# EasyEDA Pro project DCDC.eprj, schematic BOOST
Board Name: BOOST; Create Date: 2025-07-11; Page Name: BOOST; Project Name: DCDC; Schematic Name: BOOST; Update Date: 2025-07-11; Company: 嘉立创EDA; Page Size: A4; Version: V1.0
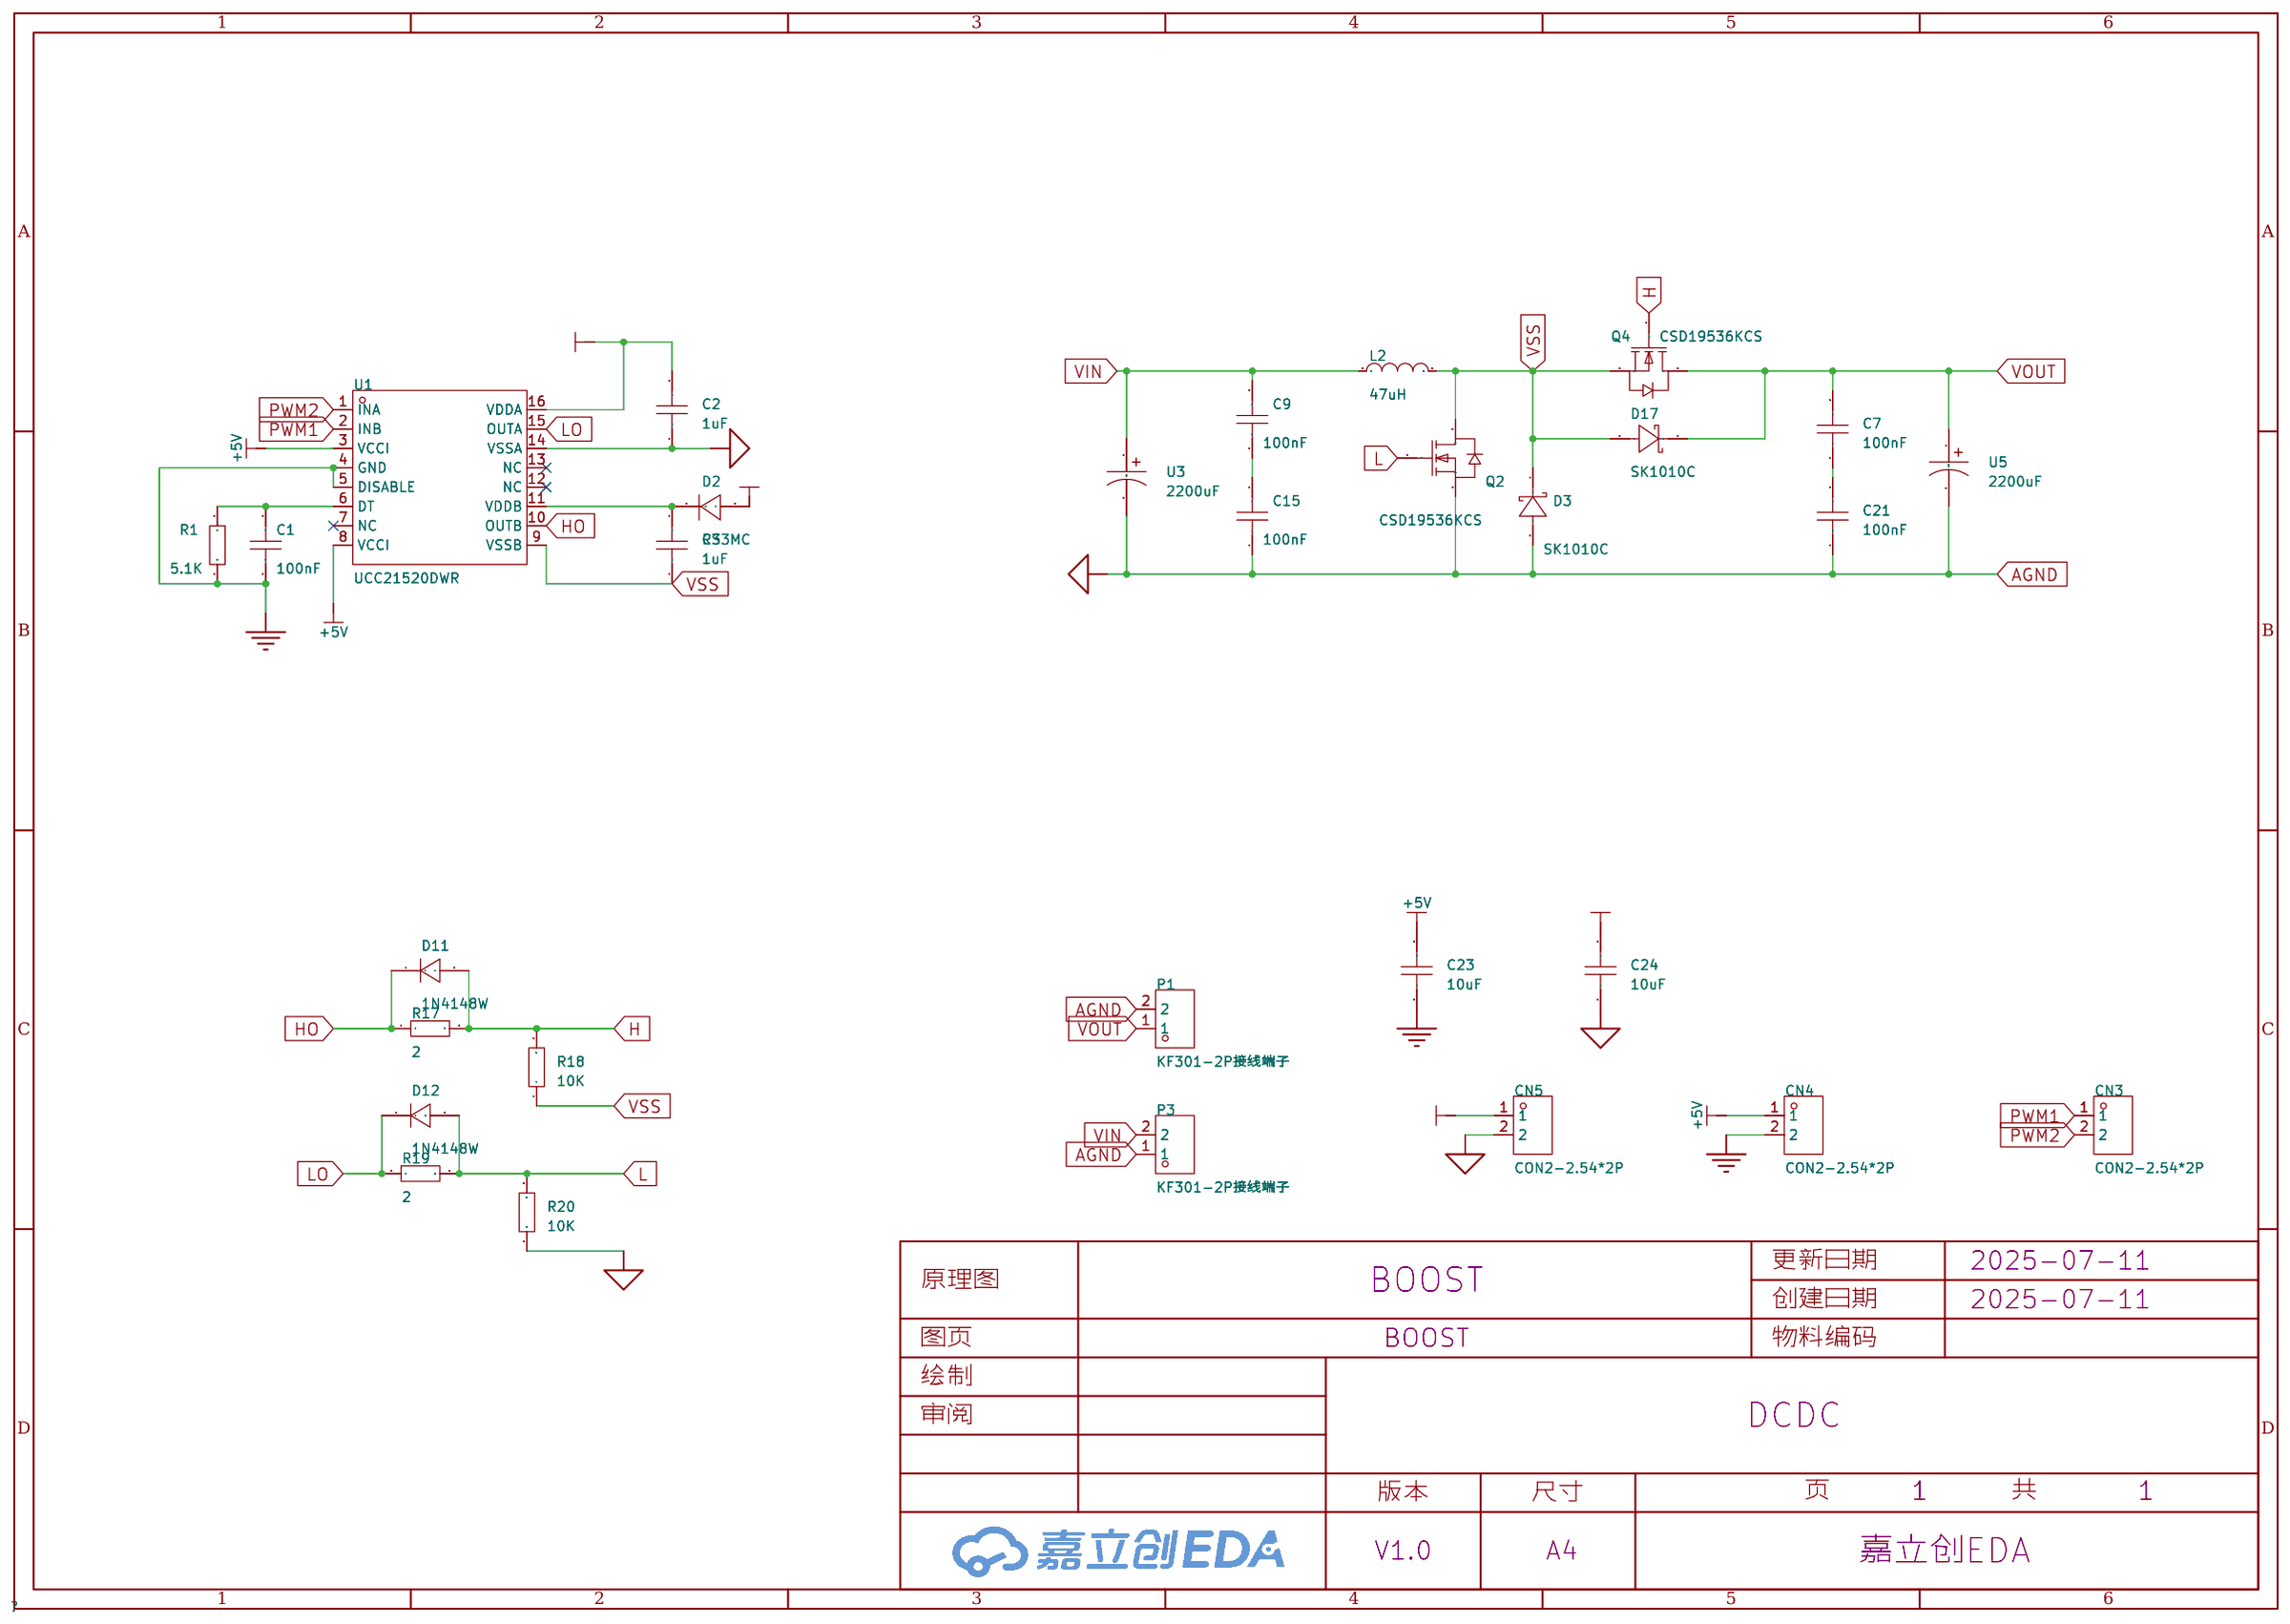
[diagram p3: schematic sheet]

## Parts
C1  100nF  [C0805]
C2  1uF  [C0805]
C3  1uF  [C0805]
C7  100nF  [C0805]
C9  100nF  [C0805]
C15  100nF  [C0805]
C21  100nF  [C0805]
C23  10uF  [C0805]
C24  10uF  [C0805]
CN3  CON2-2.54*2P  [CONN-TH_2P-P2.54-V]
CN4  CON2-2.54*2P  [CONN-TH_2P-P2.54-V]
CN5  CON2-2.54*2P  [CONN-TH_2P-P2.54-V]
D2  RS3MC  [SMC_L7.1-W6.2-LS8.1-R-RD]
D3  SK1010C  [SMC_L6.9-W5.9-LS7.9-RD]
D11  1N4148W  [SOD-123F_L2.7-W1.6-LS3.8-RD]
D12  1N4148W  [SOD-123F_L2.7-W1.6-LS3.8-RD]
D17  SK1010C  [SMC_L6.9-W5.9-LS7.9-RD]
L2  47uH  [IND-TH_L33.0-W16.0-P17.00-D1.5]
P1  KF301-2P接线端子  [CONN-TH_XY301V-A-5.0-2P]
P3  KF301-2P接线端子  [CONN-TH_XY301V-A-5.0-2P]
Q2  CSD19536KCS  [TO-220-3_L10.0-W4.5-P2.54-L]
Q4  CSD19536KCS  [TO-220-3_L10.0-W4.5-P2.54-L]
R1  5.1K  [R0805]
R17  2  [R0805]
R18  10K  [R0805]
R19  2  [R0805]
R20  10K  [R0805]
U1  UCC21520DWR  [SOIC-16_L10.3-W7.5-P1.27-LS10.3-BL]
U3  2200uF  [CAP-TH_BD22.0-P10.00-D1.4-FD]
U5  2200uF  [CAP-TH_BD22.0-P10.00-D1.4-FD]

## Library data of the parts
C1-C3 C7 C9 C15 C21 C23 C24 = CAP_0805: Supplier Footprint: 0805
CN3-CN5 = CON2-2.54*2P: Supplier Part: C9900003238; Supplier Footprint: TH-2P; JLCPCB Part Class: Extended Part; Supplier: LCSC
D2 = RS3MC_C15283: 二极管配置:独立式;正向压降(Vf):1.3V@3A;直流反向耐压(Vr):1kV;整流电流:3A;反向恢复时间(trr):500ns;; LCSC Part Name: 电压:1kV 电流:3A; Supplier Part: C15283; Manufacturer: MDD(辰达半导体); Supplier Footprint: SMC; JLCPCB Part Class: 扩展库; Datasheet: https://atta.szlcsc.com/upload/public/pdf/source/20240809/311FA8487617F5AA976E3BC15CA3A541.pdf; Supplier: LCSC; Diode Configuration: 独立式; Forward Voltage (Vf@If): 1.3V@3A; Reverse Voltage (Vr): 1kV; Rectified Current: 3A; Reverse Leakage Current: 5uA@1kV; Reverse Recovery Time (trr): 500ns; Operating Temperature: -55℃~+150℃@(Tj)
D3 D17 = SK106C_C18199210: LCSC Part Name: 电压:60V 电流:10A; Supplier Part: C18199210; Manufacturer: 宏迦橙; Supplier Footprint: SMC; JLCPCB Part Class: Extended Part; Datasheet: https://atta.szlcsc.com/upload/public/pdf/source/20230925/90F2340DC9BC2B2517F18AABBBD1A464.pdf; Supplier: LCSC; Diode Configuration: 独立式; Forward Voltage (Vf@If): 700mV@10A; Reverse Voltage (Vr): 60V; Rectified Current: 10A; Reverse Leakage Current (Ir): 500uA@60V
D11 D12 = 1N4148W_C81598: LCSC Part Name: 电压:75V 电流:150mA; Supplier Part: C81598; Manufacturer: ST(先科); Supplier Footprint: SOD-123; JLCPCB Part Class: Basic Part; Datasheet: https://atta.szlcsc.com/upload/public/pdf/source/20161024/1477288446905.pdf; Supplier: LCSC; Diode Configuration: 独立式; Forward Voltage (Vf@If): 1V@50mA; Reverse Voltage (Vr): 75V; Average Rectified Current (Io): 150mA; Power Dissipation: 400mW; Reverse Leakage Current: 1uA@75V; Reverse Recovery Time (trr): 4ns
L2 = XR106125TS470MV1L: LCSC Part Name: 带热缩套管; Supplier Part: C22358528; Manufacturer: XR(祥如); Supplier Footprint: 插件,33x15.6mm; JLCPCB Part Class: 扩展库; Datasheet: https://atta.szlcsc.com/upload/public/pdf/source/20240313/3B46D856669B9C4B865D9288641DA483.pdf; Supplier: LCSC; Tolerance: ±10%; Current Rating: 5A; Type: 磁环电感; Wire Diameter: 1mm
P1 P3 = KF301-2P接线端子: Supplier Part: C9900016950; Supplier Footprint: CK301-2P; JLCPCB Part Class: Extended Part; Supplier: LCSC
Q2 Q4 = CSD19536KCS: LCSC Part Name: 1个N沟道 耐压:100V 电流:150A; Supplier Part: C206030; Manufacturer: TI(德州仪器); Supplier Footprint: TO-220; JLCPCB Part Class: 扩展库; Datasheet: https://www.ti.com/cn/lit/gpn/csd19536kcs; Supplier: LCSC; Type: 1个N沟道; Drain Source Voltage (Vdss): 100V; Continuous Drain Current (Id): 150A; Power Dissipation (Pd): 375W; Drain Source On Resistance (RDS(on)@Vgs,Id): 2.7mΩ@10V,100A; Gate Threshold Voltage (Vgs(th)@Id): 3.2V@250uA; Total Gate Charge (Qg@Vgs): 153nC@10V; Input Capacitance (Ciss@Vds): 12nF@50V; Operating Temperature: -55℃~+175℃@(Tj)
R1 R17-R20 = Res_0805: Supplier Footprint: 0805
U1 = UCC21520DWR: Supplier Part: C601651; Manufacturer: TI(德州仪器); Supplier Footprint: SOIC-16-300mil; JLCPCB Part Class: 扩展库; Datasheet: https://www.ti.com/cn/lit/gpn/ucc21520; Supplier: LCSC
U3 U5 = ERH2WM221O46OT: LCSC Part Name: 220uF ±20% 450V; Supplier Part: C2937537; Manufacturer: AISHI(艾华集团); Supplier Footprint: 插件,D22xL46mm; JLCPCB Part Class: 扩展库; Datasheet: https://atta.szlcsc.com/upload/public/pdf/source/20211228/8DC8D1CED5B28B034FFD0D50EADAC965.pdf; Supplier: LCSC; Tolerance: ±20%; Rated Voltage: 450V; φD: 22mm; L: 46mm; Lifetime @ Temp: 3000hrs@105℃; Operating Temperature: -40℃~+105℃

## Nets
+5V: C23.2 CN4.1 U1.3(VCCI) U1.8(VCCI)
+12V: C2.2 C24.2 CN5.1 D2.1(A) U1.16(VDDA)
AGND: C2.1 C15.1 C21.1 C24.1 CN5.2 D3.2(A) P1.2 P3.1 Q2.3(S) R20.1 U1.14(VSSA) U3.2 U5.2
DGND: C1.1 C23.1 CN4.2 R1.1 U1.4(GND) U1.5(DISABLE)
VIN: C9.2 L2.1 P3.2 U3.1
VSS: C3.1 D3.1(K) D17.2(A) L2.2 Q2.2(D) Q4.3(S) R18.1 U1.9(VSSB)
H: D11.2(A) Q4.1(G) R17.2 R18.2
HO: D11.1(K) R17.1 U1.10(OUTB)
L: D12.2(A) Q2.1(G) R19.2 R20.2
LO: D12.1(K) R19.1 U1.15(OUTA)
PWM1: CN3.1 U1.2(INB)
PWM2: CN3.2 U1.1(INA)
VOUT: C7.2 D17.1(K) P1.1 Q4.2(D) U5.1
$1N383: C1.2 R1.2 U1.6(DT)
$1N415: C3.2 D2.2(K) U1.11(VDDB)
$1N4346: C9.1 C15.2
$1N5100: C7.1 C21.2

Not connected (* = marked no-connect by the designer): U1 7(NC)* 12(NC)* 13(NC)*
